# Altium schematic sheet ball_dropper_rev3.SchDoc: Fire Ball Dropper Control Board Rev2
size 508 x 266 mm; Date: 11/7/14
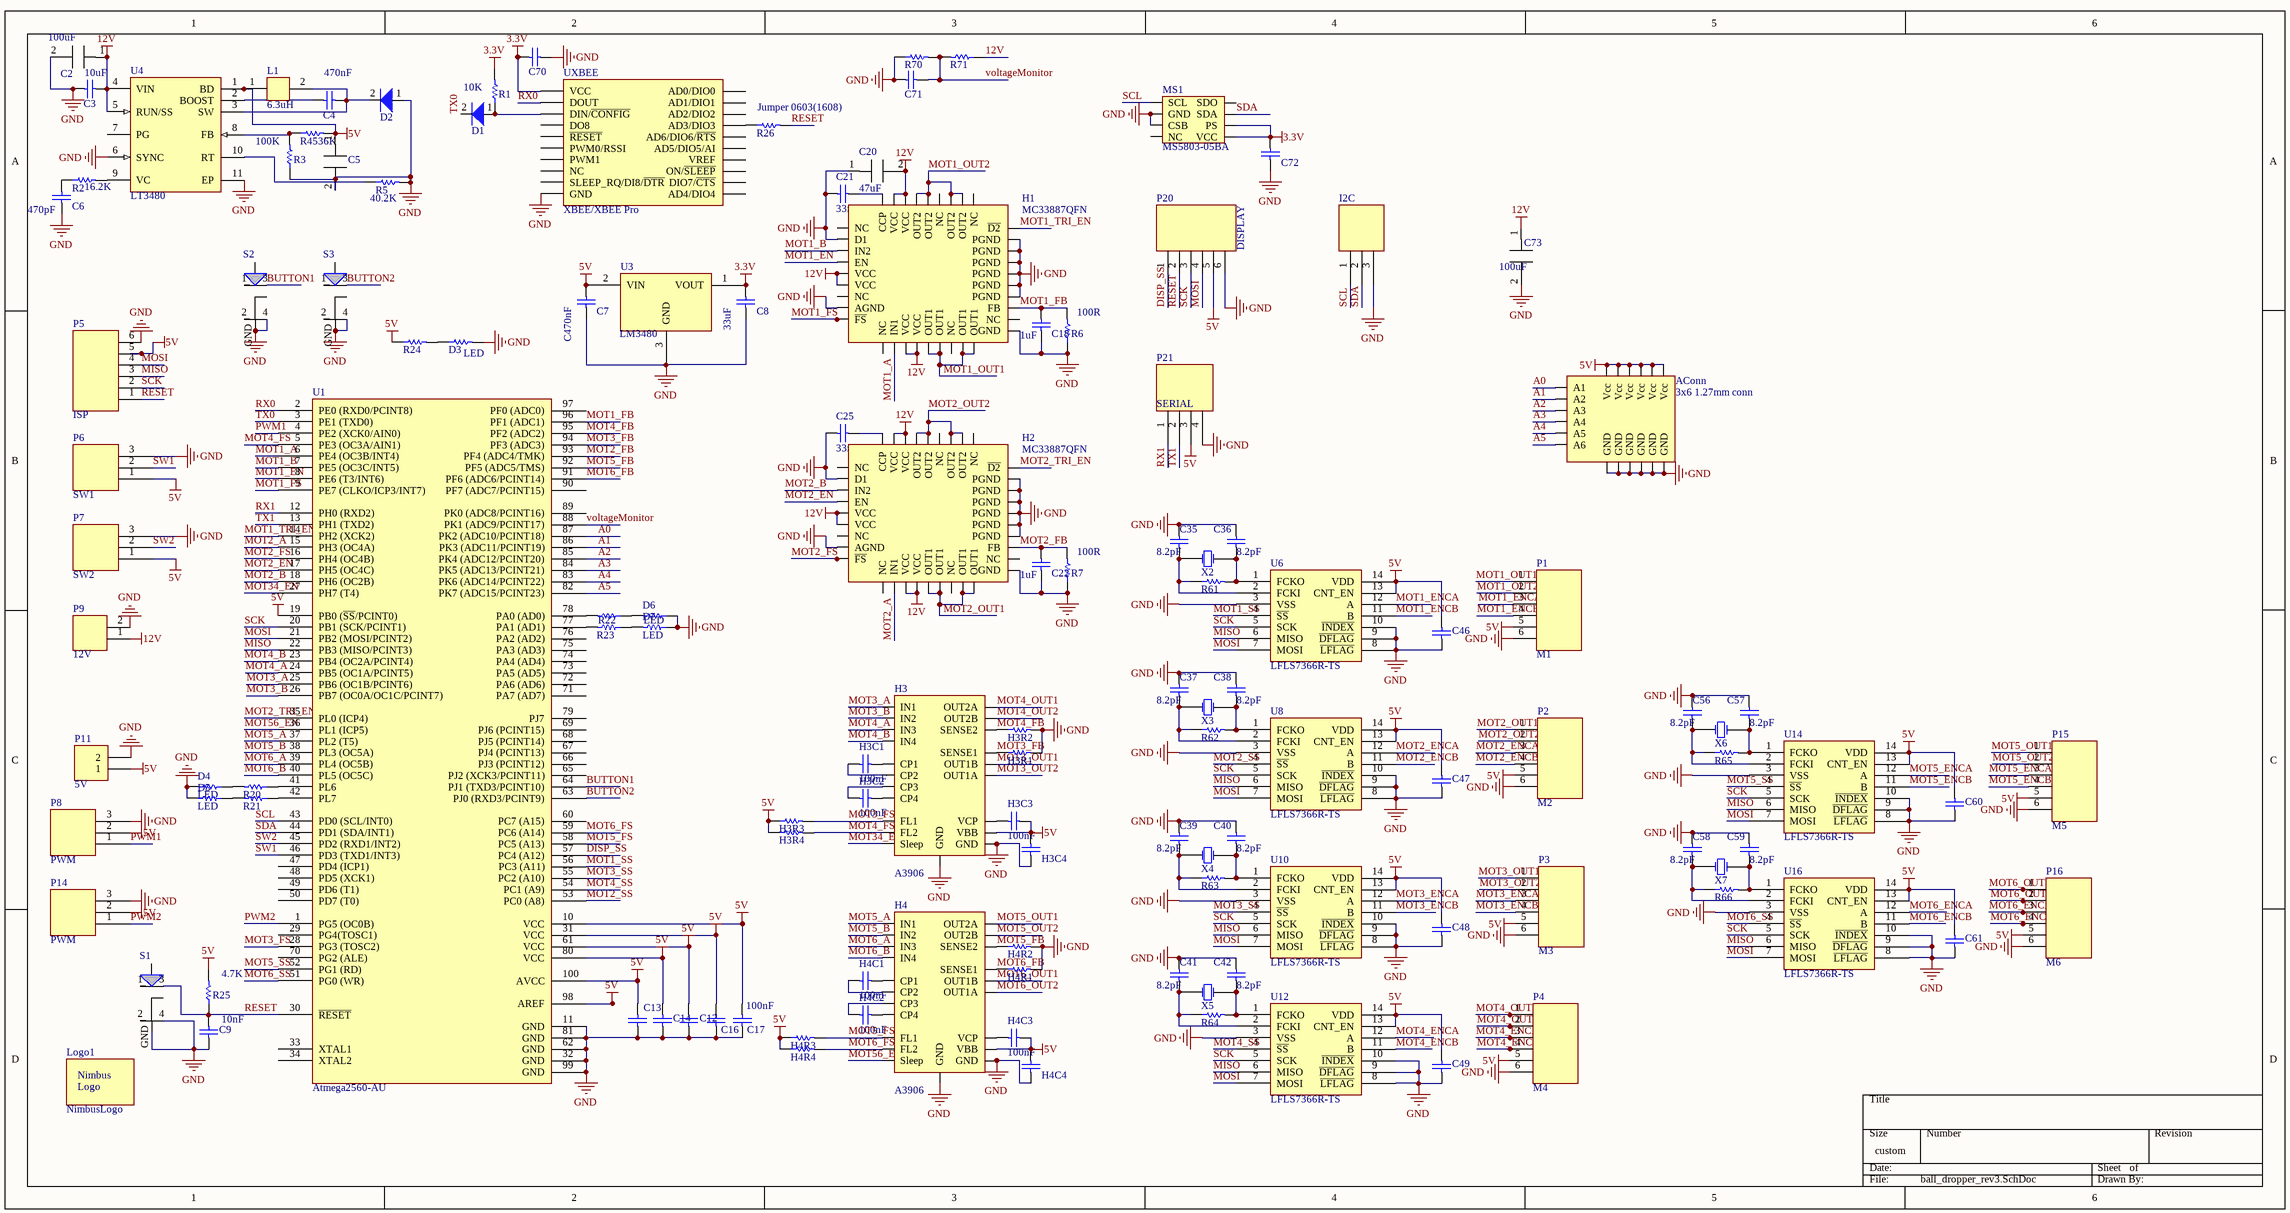
[diagram p0: ball_dropper_rev3.SchDoc]

## Parts
AConn  3x6 1.27mm conn  [3x6 1.27mm conn]
C2  100uF  [TantalumCap7343]
C3  10uF  [CAPC0603(1608)100_M]
C4  470nF  [CAPC0603(1608)100_N]
C5  47uF  [TantalumCap7343]  (value not drawn)
C6  470pF  [CAPC0603(1608)100_N]
C7  C470nF  [CAPC0603(1608)100_N]
C8  33uF  [CAPC1206(3216)190_M]
C9  10nF  [CAPC0603(1608)100_M]
C12  100nF  [CAPC0603(1608)100_N]  (value not drawn)
C13  100nF  [CAPC0603(1608)100_N]  (value not drawn)
C14  100nF  [CAPC0603(1608)100_N]  (value not drawn)
C16  100nF  [CAPC0603(1608)100_N]  (value not drawn)
C17  100nF  [CAPC0603(1608)100_N]
C18  1uF  [CAPC0603(1608)100_N]
C20  47uF  [TantalumCap7343]
C21  33nF  [CAPC0603(1608)100_N]
C22  1uF  [CAPC0603(1608)100_N]
C25  33nF  [CAPC0603(1608)100_N]
C35  8.2pF  [CAPC0603(1608)100_N]
C36  8.2pF  [CAPC0603(1608)100_N]
C37  8.2pF  [CAPC0603(1608)100_N]
C38  8.2pF  [CAPC0603(1608)100_N]
C39  8.2pF  [CAPC0603(1608)100_N]
C40  8.2pF  [CAPC0603(1608)100_N]
C41  8.2pF  [CAPC0603(1608)100_N]
C42  8.2pF  [CAPC0603(1608)100_N]
C46  100nF  [CAPC0603(1608)100_N]  (value not drawn)
C47  100nF  [CAPC0603(1608)100_N]  (value not drawn)
C48  100nF  [CAPC0603(1608)100_N]  (value not drawn)
C49  100nF  [CAPC0603(1608)100_N]  (value not drawn)
C56  8.2pF  [CAPC0603(1608)100_N]
C57  8.2pF  [CAPC0603(1608)100_N]
C58  8.2pF  [CAPC0603(1608)100_N]
C59  8.2pF  [CAPC0603(1608)100_N]
C60  100nF  [CAPC0603(1608)100_N]  (value not drawn)
C61  100nF  [CAPC0603(1608)100_N]  (value not drawn)
C70  CAP 10uF 10V 1206(3216)  [CAPC1206(3216)190_N]  (value not drawn)
C71  CAP 100nF 25V 0603(1608)  [CAPC0603(1608)100_N]  (value not drawn)
C72  CAP 100nF 25V 0603(1608)  [CAPC0603(1608)100_N]  (value not drawn)
C73  100uF  [TantalumCap7343]
D1  diode_MBRA210LT3G  [C1206]  (value not drawn)
D2  diode_B340A  [diode_B340A]  (value not drawn)
D3  LED  [RESC0603(1608)_N]
D4  LED  [RESC0603(1608)_N]
D5  LED  [RESC0603(1608)_N]
D6  LED  [RESC0603(1608)_N]
D7  LED  [RESC0603(1608)_N]
H1  MC33887QFN  [MC33887-QFN]
H2  MC33887QFN  [MC33887-QFN]
H3  A3906  [A3906-QFN]
H3C1  100nF  [CAPC0603(1608)100_N]
H3C2  100nF  [CAPC0603(1608)100_N]
H3C3  100nF  [CAPC0603(1608)100_N]
H3C4  CAP 10uF 10V 0603(1608)  [CAPC0603(1608)100_N]  (value not drawn)
H3R1  0.2R 5% 1206(3216)  [RESC1206(3216)_N]  (value not drawn)
H3R2  0.2R 5% 1206(3216)  [RESC1206(3216)_N]  (value not drawn)
H3R3  1M 5% 0603(1608)  [RESC0603(1608)_N]  (value not drawn)
H3R4  1M 5% 0603(1608)  [RESC0603(1608)_N]  (value not drawn)
H4  A3906  [A3906-QFN]
H4C1  100nF  [CAPC0603(1608)100_N]
H4C2  100nF  [CAPC0603(1608)100_N]
H4C3  100nF  [CAPC0603(1608)100_N]
H4C4  CAP 10uF 10V 0603(1608)  [CAPC0603(1608)100_N]  (value not drawn)
H4R1  0.2R 5% 1206(3216)  [RESC1206(3216)_N]  (value not drawn)
H4R2  0.2R 5% 1206(3216)  [RESC1206(3216)_N]  (value not drawn)
H4R3  1M 5% 0603(1608)  [RESC0603(1608)_N]  (value not drawn)
H4R4  1M 5% 0603(1608)  [RESC0603(1608)_N]  (value not drawn)
I2C  Hirose3  [DF3A-3P-2DS-RA]  (value not drawn)
L1  6.3uH  [CDRH62B]
Logo1  NimbusLogo  [NIMBUS Logo]
MS1  MS5803-05BA  [MS5803-05BA]
P1  M1  [DF3A-6P-2DS]
P2  M2  [DF3A-6P-2DS]
P3  M3  [DF3A-6P-2DS]
P4  M4  [DF3A-6P-2DS]
P5  ISP  [DF3A-6P-2DS]
P6  SW1  [DF3A-3P-2DS-RA]
P7  SW2  [DF3A-3P-2DS-RA]
P8  PWM  [DF3A-3P-2DS]
P9  12V  [DF3A-2P-2DS Vert]
P11  5V  [DF3A-2P-2DS]
P14  PWM  [DF3A-3P-2DS]
P15  M5  [DF3A-6P-2DS]
P16  M6  [DF3A-6P-2DS]
P20  DISPLAY  [DF3A-6P-2DS]
P21  SERIAL  [DF3A-4P-2DS]
R1  10K  [RESC0603(1608)_N]
R2  16.2K  [RESC0603(1608)_N]
R3  100K  [RESC0603(1608)_N]
R4  536K  [RESC0603(1608)_M]
R5  40.2K  [RESC0603(1608)_M]
R6  100R  [RESC0603(1608)_N]
R7  100R  [RESC0603(1608)_N]
R20  150R 5% 0603(1608)  [RESC0603(1608)_N]  (value not drawn)
R21  150R 5% 0603(1608)  [RESC0603(1608)_N]  (value not drawn)
R22  150R 5% 0603(1608)  [RESC0603(1608)_N]  (value not drawn)
R23  150R 5% 0603(1608)  [RESC0603(1608)_N]  (value not drawn)
R24  150R 5% 0603(1608)  [RESC0603(1608)_N]  (value not drawn)
R25  4.7K  [RESC0603(1608)_N]
R26  Jumper 0603(1608)  [RESC0603(1608)_N]
R61  1M 5% 0603(1608)  [RESC0603(1608)_N]  (value not drawn)
R62  1M 5% 0603(1608)  [RESC0603(1608)_N]  (value not drawn)
R63  1M 5% 0603(1608)  [RESC0603(1608)_N]  (value not drawn)
R64  1M 5% 0603(1608)  [RESC0603(1608)_N]  (value not drawn)
R65  1M 5% 0603(1608)  [RESC0603(1608)_N]  (value not drawn)
R66  1M 5% 0603(1608)  [RESC0603(1608)_N]  (value not drawn)
R70  27K 1% 0603(1608)  [RESC0603(1608)_N]  (value not drawn)
R71  90K9 1% 0603(1608)  [RESC0603(1608)_N]  (value not drawn)
S1  TactileSwitch_lp  [LOW_PROFILE_W_GND]  (value not drawn)
S2  TactileSwitch_lp  [LOW_PROFILE_W_GND]  (value not drawn)
S3  TactileSwitch_lp  [LOW_PROFILE_W_GND]  (value not drawn)
U1  Atmega2560-AU  [TSQFP50P1600X1600X160-100N]
U3  LM3480  [LM3480]
U4  LT3480  [LT-MSE-10-EDP_L]
U6  LFLS7366R-TS  [LS7366RTS]
U8  LFLS7366R-TS  [LS7366RTS]
U10  LFLS7366R-TS  [LS7366RTS]
U12  LFLS7366R-TS  [LS7366RTS]
U14  LFLS7366R-TS  [LS7366RTS]
U16  LFLS7366R-TS  [LS7366RTS]
UXBEE  XBEE/XBEE Pro  [XBEE - Surface Mount]
X2  40MHz  [xtal4]  (value not drawn)
X3  40MHz  [xtal4]  (value not drawn)
X4  40MHz  [xtal4]  (value not drawn)
X5  40MHz  [xtal4]  (value not drawn)
X6  40MHz  [xtal4]  (value not drawn)
X7  40MHz  [xtal4]  (value not drawn)

## Nets
3.3V: C8.2 C70.1 C72.2 MS1.5(VCC) MS1.6(PS) R1.2 U3.1(VOUT) UXBEE.1(VCC)
5V: AConn.2(Vcc) AConn.5(Vcc) AConn.8(Vcc) AConn.11(Vcc) AConn.14(Vcc) AConn.17(Vcc) C5.1(VCC) C7.2 C12.2 C13.2 C14.2 C16.2 C17.2 C46.2 C47.2 C48.2 C49.2 C60.2 C61.2 H3.13(VBB) H3C3.1 H3C4.2 H3R3.1 H3R4.1 H4.13(VBB) H4C3.1 H4C4.2 H4R3.1 H4R4.1 L1.1 P1.5 P2.5 P3.5 P4.5 P5.5 P6.1 P7.1 P8.2 P11.1 P14.2 P15.5 P16.5 P20.5 P21.3 R4.2 R24.1 R25.2 U1.10(VCC) U1.19(PB0_(~{SS}/PCINT0)) U1.31(VCC) U1.61(VCC) U1.80(VCC) U1.98(AREF) U1.100(AVCC) U3.2(VIN) U4.1(BD) U6.13(CNT_EN) U6.14(VDD) U8.13(CNT_EN) U8.14(VDD) U10.13(CNT_EN) U10.14(VDD) U12.13(CNT_EN) U12.14(VDD) U14.13(CNT_EN) U14.14(VDD) U16.13(CNT_EN) U16.14(VDD)
12V: C2.1(VCC) C3.2 C20.2(GND) C73.1(VCC) H1.5(VCC) H1.6(VCC) H1.12(VCC) H1.13(VCC) H1.34(VCC) H1.35(VCC) H2.5(VCC) H2.6(VCC) H2.12(VCC) H2.13(VCC) H2.34(VCC) H2.35(VCC) P9.1 R71.1 U4.4(VIN) U4.5(RUN/SS)
GND: AConn.1(GND) AConn.4(GND) AConn.7(GND) AConn.10(GND) AConn.13(GND) AConn.16(GND) C2.2(GND) C3.1 C5.2(GND) C6.1 C7.1 C8.1 C9.1 C12.1 C13.1 C14.1 C16.1 C17.1 C18.1 C20.1(VCC) C21.1 C22.1 C25.1 C35.2 C36.2 C37.2 C38.2 C39.2 C40.2 C41.2 C42.2 C46.1 C47.1 C48.1 C49.1 C56.2 C57.2 C58.2 C59.2 C60.1 C61.1 C70.2 C71.1 C72.1 C73.2(GND) D2.1 D3.2 D4.2 D5.2 D6.1 D7.1 H1.2(D1) H1.8(AGND) H1.21(PGND) H1.22(PGND) H1.23(PGND) H1.24(PGND) H1.25(PGND) H1.26(PGND) H1.37(GND) H2.2(D1) H2.8(AGND) H2.21(PGND) H2.22(PGND) H2.23(PGND) H2.24(PGND) H2.25(PGND) H2.26(PGND) H2.37(GND) H3.2(GND) H3.21(GND) H3C4.1 H3R1.2 H3R2.2 H4.2(GND) H4.21(GND) H4C4.1 H4R1.2 H4R2.2 I2C.3 MS1.2(GND) MS1.3(CSB) P1.6 P2.6 P3.6 P4.6 P5.6 P6.3 P7.3 P8.3 P9.2 P11.2 P14.3 P15.6 P16.6 P20.6 P21.4 R3.1 R5.2 R6.1 R7.1 R70.1 S1.4(GND) S1.GND S2.4(GND) S2.GND S3.4(GND) S3.GND U1.11(GND) U1.32(GND) U1.62(GND) U1.81(GND) U1.99(GND) U3.3(GND) U4.6(SYNC) U4.11(EP) U6.3(VSS) U6.8(~{LFLAG}) U6.9(~{DFLAG}) U6.10(~{INDEX}) U8.3(VSS) U8.8(~{LFLAG}) U8.9(~{DFLAG}) U8.10(~{INDEX}) U10.3(VSS) U10.8(~{LFLAG}) U10.9(~{DFLAG}) U10.10(~{INDEX}) U12.3(VSS) U12.8(~{LFLAG}) U12.9(~{DFLAG}) U12.10(~{INDEX}) U14.3(VSS) U14.8(~{LFLAG}) U14.9(~{DFLAG}) U14.10(~{INDEX}) U16.3(VSS) U16.8(~{LFLAG}) U16.9(~{DFLAG}) U16.10(~{INDEX}) UXBEE.10(GND)
A0: AConn.3(A1) U1.87(PK2_(ADC10/PCINT18))
A1: AConn.6(A2) U1.86(PK3_(ADC11/PCINT19))
A2: AConn.9(A3) U1.85(PK4_(ADC12/PCINT20))
A3: AConn.12(A4) U1.84(PK5_(ADC13/PCINT21))
A4: AConn.15(A5) U1.83(PK6_(ADC14/PCINT22))
A5: AConn.18(A6) U1.82(PK7_(ADC15/PCINT23))
BUTTON1: S2.3(GND) U1.64(PJ1_(TXD3/PCINT10))
BUTTON2: S3.3(GND) U1.63(PJ0_(RXD3/PCINT9))
DISP_SS: P20.1 U1.57(PC4_(A12))
MISO: P5.3 U1.22(PB3_(MISO/PCINT3)) U6.6(MISO) U8.6(MISO) U10.6(MISO) U12.6(MISO) U14.6(MISO) U16.6(MISO)
MOSI: P5.4 P20.4 U1.21(PB2_(MOSI/PCINT2)) U6.7(MOSI) U8.7(MOSI) U10.7(MOSI) U12.7(MOSI) U14.7(MOSI) U16.7(MOSI)
MOT1_A: H1.11(IN1) U1.6(PE4_(OC3B/INT4))
MOT1_B: H1.3(IN2) U1.7(PE5_(OC3C/INT5))
MOT1_EN: H1.4(EN) U1.8(PE6_(T3/INT6))
MOT1_ENCA: P1.3 U6.12(A)
MOT1_ENCB: P1.4 U6.11(B)
MOT1_FB: C18.2 H1.20(FB) R6.2 U1.96(PF1_(ADC1))
MOT1_FS: H1.9(~{FS}) U1.9(PE7_(CLKO/ICP3/INT7))
MOT1_OUT1: H1.14(OUT1) H1.15(OUT1) H1.17(OUT1) H1.18(OUT1) P1.1
MOT1_OUT2: H1.29(OUT2) H1.30(OUT2) H1.32(OUT2) H1.33(OUT2) P1.2
MOT1_SS: U1.56(PC3_(A11)) U6.4(~{SS})
MOT1_TRI_EN: H1.27(~{D2}) U1.14(PH2_(XCK2))
MOT2_A: H2.11(IN1) U1.15(PH3_(OC4A))
MOT2_B: H2.3(IN2) U1.18(PH6_(OC2B))
MOT2_EN: H2.4(EN) U1.17(PH5_(OC4C))
MOT2_ENCA: P2.3 U8.12(A)
MOT2_ENCB: P2.4 U8.11(B)
MOT2_FB: C22.2 H2.20(FB) R7.2 U1.93(PF4_(ADC4/TMK))
MOT2_FS: H2.9(~{FS}) U1.16(PH4_(OC4B))
MOT2_OUT1: H2.14(OUT1) H2.15(OUT1) H2.17(OUT1) H2.18(OUT1) P2.1
MOT2_OUT2: H2.29(OUT2) H2.30(OUT2) H2.32(OUT2) H2.33(OUT2) P2.2
MOT2_SS: U1.53(PC0_(A8)) U8.4(~{SS})
MOT2_TRI_EN: H2.27(~{D2}) U1.35(PL0_(ICP4))
MOT3_A: H3.4(IN1) U1.25(PB6_(OC1B/PCINT6))
MOT3_B: H3.5(IN2) U1.26(PB7_(OC0A/OC1C/PCINT7))
MOT3_ENCA: P3.3 U10.12(A)
MOT3_ENCB: P3.4 U10.11(B)
MOT3_FB: H3.15(SENSE1) H3R1.1 U1.94(PF3_(ADC3))
MOT3_FS: H3.8(FL1) H3R3.2 U1.28(PG3_(TOSC2))
MOT3_OUT1: H3.14(OUT1B) P3.1
MOT3_OUT2: H3.16(OUT1A) P3.2
MOT3_SS: U1.55(PC2_(A10)) U10.4(~{SS})
MOT4_A: H3.6(IN3) U1.24(PB5_(OC1A/PCINT5))
MOT4_B: H3.7(IN4) U1.23(PB4_(OC2A/PCINT4))
MOT4_ENCA: P4.3 U12.12(A)
MOT4_ENCB: P4.4 U12.11(B)
MOT4_FB: H3.11(SENSE2) H3R2.1 U1.95(PF2_(ADC2))
MOT4_FS: H3.9(FL2) H3R4.2 U1.5(PE3_(OC3A/AIN1))
MOT4_OUT1: H3.10(OUT2A) P4.1
MOT4_OUT2: H3.12(OUT2B) P4.2
MOT4_SS: U1.54(PC1_(A9)) U12.4(~{SS})
MOT5_A: H4.4(IN1) U1.37(PL2_(T5))
MOT5_B: H4.5(IN2) U1.38(PL3_(OC5A))
MOT5_ENCA: P15.3 U14.12(A)
MOT5_ENCB: P15.4 U14.11(B)
MOT5_FB: H4.11(SENSE2) H4R2.1 U1.92(PF5_(ADC5/TMS))
MOT5_FS: H4.8(FL1) H4R3.2 U1.58(PC5_(A13))
MOT5_OUT1: H4.10(OUT2A) P15.1
MOT5_OUT2: H4.12(OUT2B) P15.2
MOT5_SS: U1.52(PG1_(RD)) U14.4(~{SS})
MOT6_A: H4.6(IN3) U1.39(PL4_(OC5B))
MOT6_B: H4.7(IN4) U1.40(PL5_(OC5C))
MOT6_ENCA: P16.3 U16.12(A)
MOT6_ENCB: P16.4 U16.11(B)
MOT6_FB: H4.15(SENSE1) H4R1.1 U1.91(PF6_(ADC6/PCINT14))
MOT6_FS: H4.9(FL2) H4R4.2 U1.59(PC6_(A14))
MOT6_OUT1: H4.14(OUT1B) P16.1
MOT6_OUT2: H4.16(OUT1A) P16.2
MOT6_SS: U1.51(PG0_(WR)) U16.4(~{SS})
MOT34_EN: H3.3(Sleep) U1.27(PH7_(T4))
MOT56_EN: H4.3(Sleep) U1.36(PL1_(ICP5))
PWM1: P8.1 U1.4(PE2_(XCK0/AIN0))
PWM2: P14.1 U1.1(PG5_(OC0B))
RESET: C9.2 P5.1 P20.2 R25.1 R26.2 S1.3(GND) U1.30(~{RESET})
RX0: U1.2(PE0_(RXD0/PCINT8)) UXBEE.2(DOUT)
RX1: P21.1 U1.12(PH0_(RXD2))
SCK: P5.2 P20.3 U1.20(PB1_(SCK/PCINT1)) U6.5(SCK) U8.5(SCK) U10.5(SCK) U12.5(SCK) U14.5(SCK) U16.5(SCK)
SCL: I2C.1 MS1.1(SCL) U1.43(PD0_(SCL/INT0))
SDA: I2C.2 MS1.7(SDA) U1.44(PD1_(SDA/INT1))
SW1: P6.2 U1.46(PD3_(TXD1/INT3))
SW2: P7.2 U1.45(PD2_(RXD1/INT2))
TX0: D1.2 U1.3(PE1_(TXD0))
TX1: P21.2 U1.13(PH1_(TXD2))
voltageMonitor: C71.2 R70.2 R71.2 U1.88(PK1_(ADC9/PCINT17))
NetC4_1: C4.1 U4.2(BOOST)
NetC4_2: C4.2 D2.2 L1.2 U4.3(SW)
NetC6_2: C6.2 R2.1
NetC21_2: C21.2 H1.36(CCP)
NetC25_2: C25.2 H2.36(CCP)
NetC35_1: C35.1 R61.1 U6.2(FCKI) X2.4(OSC1)
NetC36_1: C36.1 R61.2 U6.1(FCKO) X2.2(OSC2)
NetC37_1: C37.1 R62.1 U8.2(FCKI) X3.4(OSC1)
NetC38_1: C38.1 R62.2 U8.1(FCKO) X3.2(OSC2)
NetC39_1: C39.1 R63.1 U10.2(FCKI) X4.4(OSC1)
NetC40_1: C40.1 R63.2 U10.1(FCKO) X4.2(OSC2)
NetC41_1: C41.1 R64.1 U12.2(FCKI) X5.4(OSC1)
NetC42_1: C42.1 R64.2 U12.1(FCKO) X5.2(OSC2)
NetC56_1: C56.1 R65.1 U14.2(FCKI) X6.4(OSC1)
NetC57_1: C57.1 R65.2 U14.1(FCKO) X6.2(OSC2)
NetC58_1: C58.1 R66.1 U16.2(FCKI) X7.4(OSC1)
NetC59_1: C59.1 R66.2 U16.1(FCKO) X7.2(OSC2)
NetD1_1: D1.1 R1.1 UXBEE.3(DIN/~{CONFIG})
NetD3_1: D3.1 R24.2
NetD4_1: D4.1 R20.2
NetD5_1: D5.1 R21.2
NetD6_2: D6.2 R22.1
NetD7_2: D7.2 R23.1
NetH3_1: H3.1(CP2) H3C1.2
NetH3_17: H3.17(VCP) H3C3.2
NetH3_18: H3.18(CP3) H3C2.2
NetH3_19: H3.19(CP1) H3C1.1
NetH3_20: H3.20(CP4) H3C2.1
NetH4_1: H4.1(CP2) H4C1.2
NetH4_17: H4.17(VCP) H4C3.2
NetH4_18: H4.18(CP3) H4C2.2
NetH4_19: H4.19(CP1) H4C1.1
NetH4_20: H4.20(CP4) H4C2.1
NetR2_2: R2.2 U4.9(VC)
NetR3_2: R3.2 R4.1 U4.8(FB)
NetR5_1: R5.1 U4.10(RT)
NetR20_1: R20.1 U1.41(PL6)
NetR21_1: R21.1 U1.42(PL7)
NetR22_2: R22.2 U1.78(PA0_(AD0))
NetR23_2: R23.2 U1.77(PA1_(AD1))
NetR26_1: R26.1 UXBEE.17(AD3/DIO3)

Not connected (* = marked no-connect by the designer): H1 1(NC) 7(NC) 10(NC) 16(NC) 19(NC) 28(NC) 31(NC); H2 1(NC) 7(NC) 10(NC) 16(NC) 19(NC) 28(NC) 31(NC); MS1 4(NC) 8(SDO); S1 1(GND) 2(GND); S2 1(GND) 2(GND); S3 1(GND) 2(GND); U1 29(PG4(TOSC1)) 33(XTAL1) 34(XTAL2) 47(PD4_(ICP1)) 48(PD5_(XCK1)) 49(PD6_(T1)) 50(PD7_(T0)) 60(PC7_(A15)) 65(PJ2_(XCK3/PCINT11)) 66(PJ3_(PCINT12)) 67(PJ4_(PCINT13)) 68(PJ5_(PCINT14)) 69(PJ6_(PCINT15)) 70(PG2_(ALE)) 71(PA7_(AD7)) 72(PA6_(AD6)) 73(PA5_(AD5)) 74(PA4_(AD4)) 75(PA3_(AD3)) 76(PA2_(AD2)) 79(PJ7) 89(PK0_(ADC8/PCINT16)) 90(PF7_(ADC7/PCINT15)) 97(PF0_(ADC0)); U4 7(PG); UXBEE 4(DO8) 5(~{RESET}) 6(PWM0/RSSI) 7(PWM1) 8(NC) 9(SLEEP_RQ/DI8/~{DTR}) 11(AD4/DIO4) 12(DIO7/~{CTS}) 13(ON/~{SLEEP}) 14(VREF) 15(AD5/DIO5/AI) 16(AD6/DIO6/~{RTS}) 18(AD2/DIO2) 19(AD1/DIO1) 20(AD0/DIO0)

## Notes on the sheet
- (in symbol NimbusLogo) Nimbus; Logo

## Library data of the parts
C2 C5 C20 = TantalumCap7343
  C2: C: 100uF
  C5 C20: C: 47uF
C3 = CMP-1035-02800-1: CAP 10uF 10V ±20% 0603 (1608 Metric) Thickness 1mm SMD; Case-EIA: 0603; Case-Metric: 1608; Tolerance: ±20%; Max Thickness: 1 mm; Rated Voltage: 10 V; Technology: SMT; Value: 10uF
C4 = CMP-1035-02701-1: CAP 470nF 16V ±20% 0603 (1608 Metric) Thickness 1mm SMD; Case-EIA: 0603; Case-Metric: 1608; Rated Voltage: 16 V; Max Thickness: 1 mm; Value: 470nF; Technology: SMT; Tolerance: ±20%
C6 = CMP-1035-01664-1: CAP 470pF 16V ±2% 0603 (1608 Metric) Thickness 1mm SMD; Case-EIA: 0603; Case-Metric: 1608; Rated Voltage: 16 V; Max Thickness: 1 mm; Tolerance: ±2%; Technology: SMT; Value: 470pF
C7 = CMP-1035-02696-1: CAP 470nF 10V ±10% 0603 (1608 Metric) Thickness 1mm SMD; Case-EIA: 0603; Case-Metric: 1608; Tolerance: ±10%; Max Thickness: 1 mm; Value: 470nF; Technology: SMT; Rated Voltage: 10 V
C8 = CMP-1037-04997-1: CAP 33uF 10V ±20% 1206 (3216 Metric) Thickness 1.9mm SMD; Case-EIA: 1206; Case-Metric: 3216; Technology: SMT; Max Thickness: 1.9 mm; Rated Voltage: 10 V; Tolerance: ±20%; Value: 33uF
C9 = CMP-1035-02304-1: CAP 10nF 10V ±2% 0603 (1608 Metric) Thickness 1mm SMD; Case-EIA: 0603; Case-Metric: 1608; Technology: SMT; Tolerance: ±2%; Rated Voltage: 10 V; Value: 10nF; Max Thickness: 1 mm
C12-C14 C16 C17 C46-C49 C60 C61 H3C1-H3C3 H4C1-H4C3 = CMP-1035-02582-1: CAP 100nF 10V -20% to +80% 0603 (1608 Metric) Thickness 1mm SMD; Case-Metric: 1608; Case-EIA: 0603; Rated Voltage: 10 V; Value: 100nF; Technology: SMT; Max Thickness: 1 mm; Tolerance: -20% to +80%
C18 C22 = CMP-1035-02740-1: CAP 1uF 25V ±10% 0603 (1608 Metric) Thickness 1mm SMD; Case-Metric: 1608; Case-EIA: 0603; Technology: SMT; Tolerance: ±10%; Rated Voltage: 25 V; Max Thickness: 1 mm; Value: 1uF
C21 C25 = CMP-1035-02463-1: CAP 33nF 25V ±5% 0603 (1608 Metric) Thickness 1mm SMD; Case-Metric: 1608; Case-EIA: 0603; Technology: SMT; Value: 33nF; Max Thickness: 1 mm; Rated Voltage: 25 V; Tolerance: ±5%
C35-C42 C56-C59 = CMP-1035-00477-1: CAP 8.2pF 10V ±0.1pF 0603 (1608 Metric) Thickness 1mm SMD; Case-EIA: 0603; Case-Metric: 1608; Tolerance: ±0.1pF; Max Thickness: 1 mm; Value: 8.2pF; Technology: SMT; Rated Voltage: 10 V
C70 = CMP-1037-04966-1: CAP 10uF 10V Â±5% 1206 (3216 Metric) Thickness 1.9mm SMD; Case-Metric: 3216; Case-EIA: 1206; Max Thickness: 1.9 mm; Value: 10uF; Rated Voltage: 10 V; Technology: SMT; Tolerance: Â±5%
C71 C72 = CMP-1035-02587-1: CAP 100nF 25V ±5% 0603 (1608 Metric) Thickness 1mm SMD; Case-EIA: 0603; Tolerance: Â±5%; Case-Metric: 1608; Technology: SMT; Max Thickness: 1 mm; Rated Voltage: 25 V; Value: 100nF
C73 = TantalumCap7343: C: 47uF
D3-D7 = CMP-1012-00001-1: Case-Metric: 1608; Value: 0.00 Ohm; Power: None; Case-EIA: 0603; Technology: SMT; Tolerance: None
H3C4 H4C4 = CMP-1035-02799-1: CAP 10uF 10V Â±10% 0603 (1608 Metric) Thickness 1mm SMD; Case-Metric: 1608; Case-EIA: 0603; Max Thickness: 1 mm; Tolerance: Â±10%; Technology: SMT; Rated Voltage: 10 V; Value: 10uF
H3R1 H3R2 H4R1 H4R2 = CMP-1014-00002-1: 0.2R 0.25W 5% 1206 (3216 Metric)  SMD; Value: 1.00 Ohm; Case-EIA: 1206; Case-Metric: 3216; Technology: SMT; Tolerance: 5 %; Power: 0.25 W
H3R3 H3R4 H4R3 H4R4 = CMP-1012-00054-1: 1M 0.1W 5% 0603 (1608 Metric)  SMD; Case-EIA: 0603; Value: 150.00 Ohm; Case-Metric: 1608; Power: 0.1 W; Tolerance: 5 %; Technology: SMT
L1 = TYS6045_inductor
P1-P5 P15 P16 P20 = Hirose6
P6-P8 P14 = Hirose3
P9 = Hirose2
P11 = Header 2: Header, 2-Pin; LatestRevisionDate: 17-Jul-2002; LatestRevisionNote: Re-released for DXP Platform.; Publisher: Altium Limited
P21 = Hirose4
R1 = CMP-1012-00098-1: 10K 0.1W 5% 0603 (1608 Metric)  SMD; Case-EIA: 0603; Value: 10000.00 Ohm; Case-Metric: 1608; Technology: SMT; Tolerance: 5 %; Power: 0.1 W
R2 = CMP-1012-00645-1: 16K2 0.1W 1% 0603 (1608 Metric)  SMD; Case-EIA: 0603; Value: 16200.00 Ohm; Case-Metric: 1608; Power: 0.1 W; Tolerance: 1 %; Technology: SMT
R3 = CMP-1012-00122-1: 100K 0.1W 5% 0603 (1608 Metric)  SMD; Case-EIA: 0603; Value: 100000.00 Ohm; Case-Metric: 1608; Tolerance: 5 %; Power: 0.1 W; Technology: SMT
R4 = CMP-1012-00819-1: 536K 0.1W 1% 0603 (1608 Metric)  SMD; Case-EIA: 0603; Case-Metric: 1608; Value: 536000.00 Ohm; Tolerance: 1 %; Power: 0.1 W; Technology: SMT
R5 = CMP-1012-00691-1: 40K2 0.1W 1% 0603 (1608 Metric)  SMD; Case-Metric: 1608; Value: 40200.00 Ohm; Case-EIA: 0603; Tolerance: 1 %; Technology: SMT; Power: 0.1 W
R6 R7 = CMP-1012-00050-1: 100R 0.1W 5% 0603 (1608 Metric)  SMD; Case-EIA: 0603; Value: 100.00 Ohm; Case-Metric: 1608; Tolerance: 5 %; Technology: SMT; Power: 0.1 W
R20-R24 = CMP-1012-00054-1: 150R 0.1W 5% 0603 (1608 Metric)  SMD; Case-EIA: 0603; Value: 150.00 Ohm; Case-Metric: 1608; Power: 0.1 W; Tolerance: 5 %; Technology: SMT
R25 = CMP-1012-00090-1: 4K7 0.1W 5% 0603 (1608 Metric)  SMD; Case-Metric: 1608; Value: 4700.00 Ohm; Case-EIA: 0603; Tolerance: 5 %; Technology: SMT; Power: 0.1 W
R26 = CMP-1012-00001-1: Jumper 0603 (1608 Metric); Case-Metric: 1608; Value: 0.00 Ohm; Power: None; Case-EIA: 0603; Technology: SMT; Tolerance: None
R61-R66 = CMP-1012-00146-1: 1M 0.1W 5% 0603 (1608 Metric)  SMD; Case-EIA: 0603; Value: 1000000.00 Ohm; Case-Metric: 1608; Technology: SMT; Power: 0.1 W; Tolerance: 5 %
R70 = CMP-1012-00670-1: 27K 0.1W 1% 0603 (1608 Metric)  SMD; Case-EIA: 0603; Case-Metric: 1608; Value: 27000.00 Ohm; Technology: SMT; Power: 0.1 W; Tolerance: 1 %
R71 = CMP-1012-00731-1: 90K9 0.1W 1% 0603 (1608 Metric)  SMD; Value: 90900.00 Ohm; Case-Metric: 1608; Case-EIA: 0603; Power: 0.1 W; Technology: SMT; Tolerance: 1 %
U1 = Atmega2560-AU: ATMEGA2560-16AURCT-ND
U3 = LM3480: LM3480IM3-3.3/NOPBCT-ND
U4 = CMP-0491-01005-1: 2 A, 2.4 MHz Step-Down Switching Regulator with 70 uA Quiescent Current, 10-pin SOP (MSE-10-EDP), -40 to 85 degC, Pb-Free, Tape and Reel; PartNumber: LT3480EMSE#TRPBF; Manufacturer: Linear Technology; Number of Outputs: 1; Over Voltage Protection(V): 60; ComponentLink3Description: Package Specification; PackageVersion: Rev. I, 05/2013; PackageDescription: 10-Pin Plastic MSOP, Exposed Die Pad, Body 3 x 3 mm, Pitch 0.5 mm; ComponentLink1URL: http://www.linear.com/; ComponentLink3URL: http://cds.linear.com/docs/en/packaging/05081664_I_MSE.pdf; ComponentLink1Description: Manufacturer URL; PackageReference: MSE-10; RoHS: TRUE; Packing: Tape and Reel; Mounting Technology: Surface Mount; ComponentLink2Description: Datasheet; ComponentLink2URL: http://cds.linear.com/docs/en/datasheet/3480fe.pdf
UXBEE = Xbee Pro
X2-X7 = xtal4